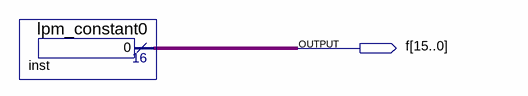
[diagram p0: schematic sheet]
// Quartus schematic clr.bdf as structural Verilog: 1 symbols, 1 pins
module clr (
  output [15:0] f
);

  lpm_constant0 inst (.result(f));
endmodule
